# Altium schematic sheet UPS_controller.SchDoc
size A4; DocumentNumber: 1; SheetNumber: 1; SheetTotal: 6
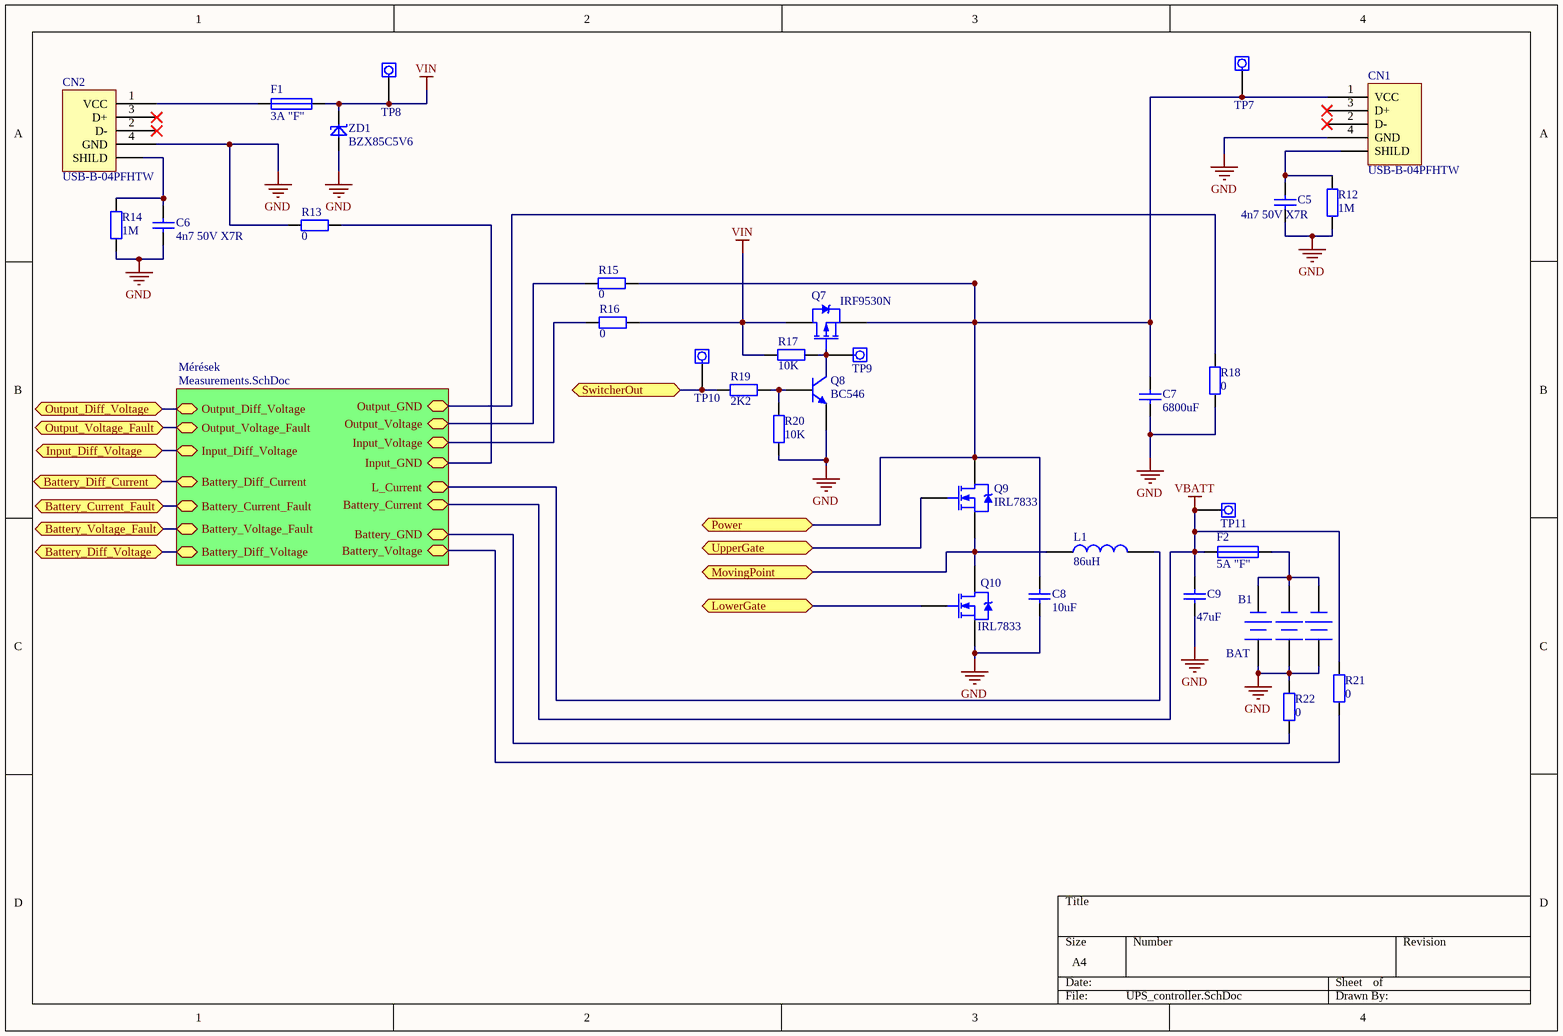
[diagram p0: UPS_controller.SchDoc]

## Parts
B1  BAT  [Elemtarto_3rekesz]
C5  4n7 50V X7R  [0805_C]
C6  4n7 50V X7R  [0805_C]
C7  value 6800uF  [ELKO RM10.16 d=2]  (hidden comment: 5600uF)
C8  10uF  [FP_0805_CAP_085]
C9  47uF  [FP_1206_CAP_125]
CN1  USB-B-04PFHTW  [USB-B]
CN2  USB-B-04PFHTW  [USB-B]
F1  3A "F"  [BIZTOSITO_5X20]
F2  5A "F"  [BIZTOSITO_5X20]
L1  86uH  [toroid]
Q7  IRF9530N  [TO-220-AB]
Q8  BC546  [TO-92]
Q9  IRL7833  [TO-220-AB]
Q10  IRL7833  [TO-220-AB]
R12  1M  [FP_0805_RES]
R13  0  [FP_0805_0ohm]
R14  1M  [FP_0805_RES]
R15  0  [FP_0805_0ohm]
R16  0  [FP_0805_0ohm]
R17  10K  [AXIAL-0.3]
R18  0  [FP_0805_0ohm]
R19  2K2  [AXIAL-0.3]
R20  10K  [AXIAL-0.3]
R21  0  [FP_0805_0ohm]
R22  0  [FP_0805_0ohm]
TP7  Testpoint  [TESTPOINT_1.5]  (value not drawn)
TP8  Testpoint  [TESTPOINT_1.5]  (value not drawn)
TP9  Testpoint  [TESTPOINT_1.5]  (value not drawn)
TP10  Testpoint  [TESTPOINT_1.5]  (value not drawn)
TP11  Testpoint  [TESTPOINT_1.5]  (value not drawn)
ZD1  BZX85C5V6  [DO-41-400]

## Sub-sheets
Mérések = Measurements.SchDoc: Output_Voltage, Output_GND, Input_Voltage, Battery_Voltage, Battery_GND, L_Current, Battery_Current, Input_GND, Output_Diff_Voltage, Input_Diff_Voltage, Battery_Diff_Voltage, Battery_Diff_Current, Battery_Current_Fault, Battery_Voltage_Fault, Output_Voltage_Fault

## Ports
Battery_Current_Fault, Battery_Diff_Current, Battery_Diff_Voltage, Battery_Voltage_Fault, Input_Diff_Voltage, LowerGate, MovingPoint, Output_Diff_Voltage, Output_Voltage_Fault, Power, SwitcherOut, UpperGate

## Nets
GND: B1.1(GND) B1.2(GND) B1.3(GND) C5.2 C6.2 C7.2 C8.1 C9.1 CN1.4(GND) CN2.4(GND) Q8.3(E) Q10.3(S) R12.1 R13.1 R14.1 R18.1 R20.1 R22.1 ZD1.1(A)
VBATT: C9.2 F2.2 R21.1 TP11.1 ; sheet Mérések/Battery_Current
VIN: F1.1 Q7.2(D) R16.2 R17.2 TP8.1 ZD1.2(K)
Battery_Current_Fault: port Battery_Current_Fault, sheet Mérések/Battery_Current_Fault
Battery_Diff_Current: port Battery_Diff_Current, sheet Mérések/Battery_Diff_Current
Battery_Diff_Voltage: port Battery_Diff_Voltage, sheet Mérések/Battery_Diff_Voltage
Battery_Voltage_Fault: port Battery_Voltage_Fault, sheet Mérések/Battery_Voltage_Fault
Input_Diff_Voltage: port Input_Diff_Voltage, sheet Mérések/Input_Diff_Voltage
LowerGate: Q10.1(G) ; port LowerGate
MovingPoint: L1.1 Q9.3(S) Q10.2(D) ; port MovingPoint
Output_Diff_Voltage: port Output_Diff_Voltage, sheet Mérések/Output_Diff_Voltage
Output_Voltage_Fault: port Output_Voltage_Fault, sheet Mérések/Output_Voltage_Fault
Power: C7.1 C8.2 CN1.1(VCC) Q7.3(S) Q9.2(D) R15.2 TP7.1 ; port Power
SwitcherOut: R19.1 TP10.1 ; port SwitcherOut
UpperGate: Q9.1(G) ; port UpperGate
NetB1_4: B1.4(VCC) B1.5(VCC) B1.6(VCC) F2.1
NetC5_1: C5.1 CN1.0(SHILD) R12.2
NetC6_1: C6.1 CN2.0(SHILD) R14.2
NetCN2_1: CN2.1(VCC) F1.2
NetL1_2: L1.2 ; sheet Mérések/L_Current
NetQ7_1: Q7.1(G) Q8.1(C) R17.1 TP9.1
NetQ8_2: Q8.2(B) R19.2 R20.2
NetR13_2: R13.2 ; sheet Mérések/Input_GND
NetR15_1: R15.1 ; sheet Mérések/Output_Voltage
NetR16_1: R16.1 ; sheet Mérések/Input_Voltage
NetR18_2: R18.2 ; sheet Mérések/Output_GND
NetR21_2: R21.2 ; sheet Mérések/Battery_Voltage
NetR22_2: R22.2 ; sheet Mérések/Battery_GND

Not connected (* = marked no-connect by the designer): CN1 2(D-)* 3(D+)*; CN2 2(D-)* 3(D+)*

## Library data of the parts
C5 C6 = Capacitor_SMD: SMD kondenzátorok; CompType: CC0805KRX7R9BB472; Distributor: Lomex; Order Code: 82-00-71; Package: 0805; Part Class: Capacitor; Value: 4n7 50V X7R
C7 = CAP: Capacitor; Voltage: 16V; Supplier: Yageo
C8 = CAP: Capacitor; Voltage: 6.3V; Supplier: X5R CL10A106MQ8NNNC; Value: 10uF; Lomex NR: 82-08-32
C9 = CAP: Capacitor; Voltage: 6V3; Value: 47uF; Supplier: X5R CL31A476MQHNNNE; Lomex NR: 82-08-04
CN1 CN2 = USB-B: Part Class: Connector; Note: HORIZONTAL PCB FEMALE NYÁK 90°; Distributor: Lomex; Order Code: 43-14-75; Package: USB-B 4P ANYA 90°; Price: 80; CompType: USB-B-04PFHTW
F1 F2 = Fuse: Part Class: Other; Order Code: 44-01-84, 44-01-85, 44-00-57; CompType: PTF/15, BS/140NA,; Note: BIZTOSITÉK FOGL.  (STE) (503.300) 5x20 + fedél (503.310) + bizt.; Distributor: Lomex
  F1: Value: 3A "F"
  F2: Value: 5A "F"
L1 = IND: Inductor; Value: 86uH
Q7 = IRF9530N: P-MOSFET; Lomex NR: 21-01-94
Q8 = BC546: NPN tranzisztor; Lomex NR: 21-11-18
Q9 Q10 = IRL7833: N-FET; Lomex NR: 82-07-81
R12-R22 = RES: Resistor
  R12 R14: Value: 1M
  R13 R15 R16 R18 R21 R22: Value: 0
  R17 R20: Value: 10K
  R19: Value: 2K2
TP7-TP11 = Testpoint: Part Class: Connector
ZD1 = BZX85C5V6: Zener Diode 5V6 1.3W DO-41; Part Class: Semiconductor; K_Manufacturer: (VIS); Note: 5.6 V 1.3 W; Distributor: Lomex; Order Code: 18-01-92; Package: DO-41; CompType: BZX85C5V6